# EAGLE schematic EEZ CF-DIC r3B3 (EAGLE 6.1)
Assembly variants: Farnell, TME

## Sheet 1 of 3
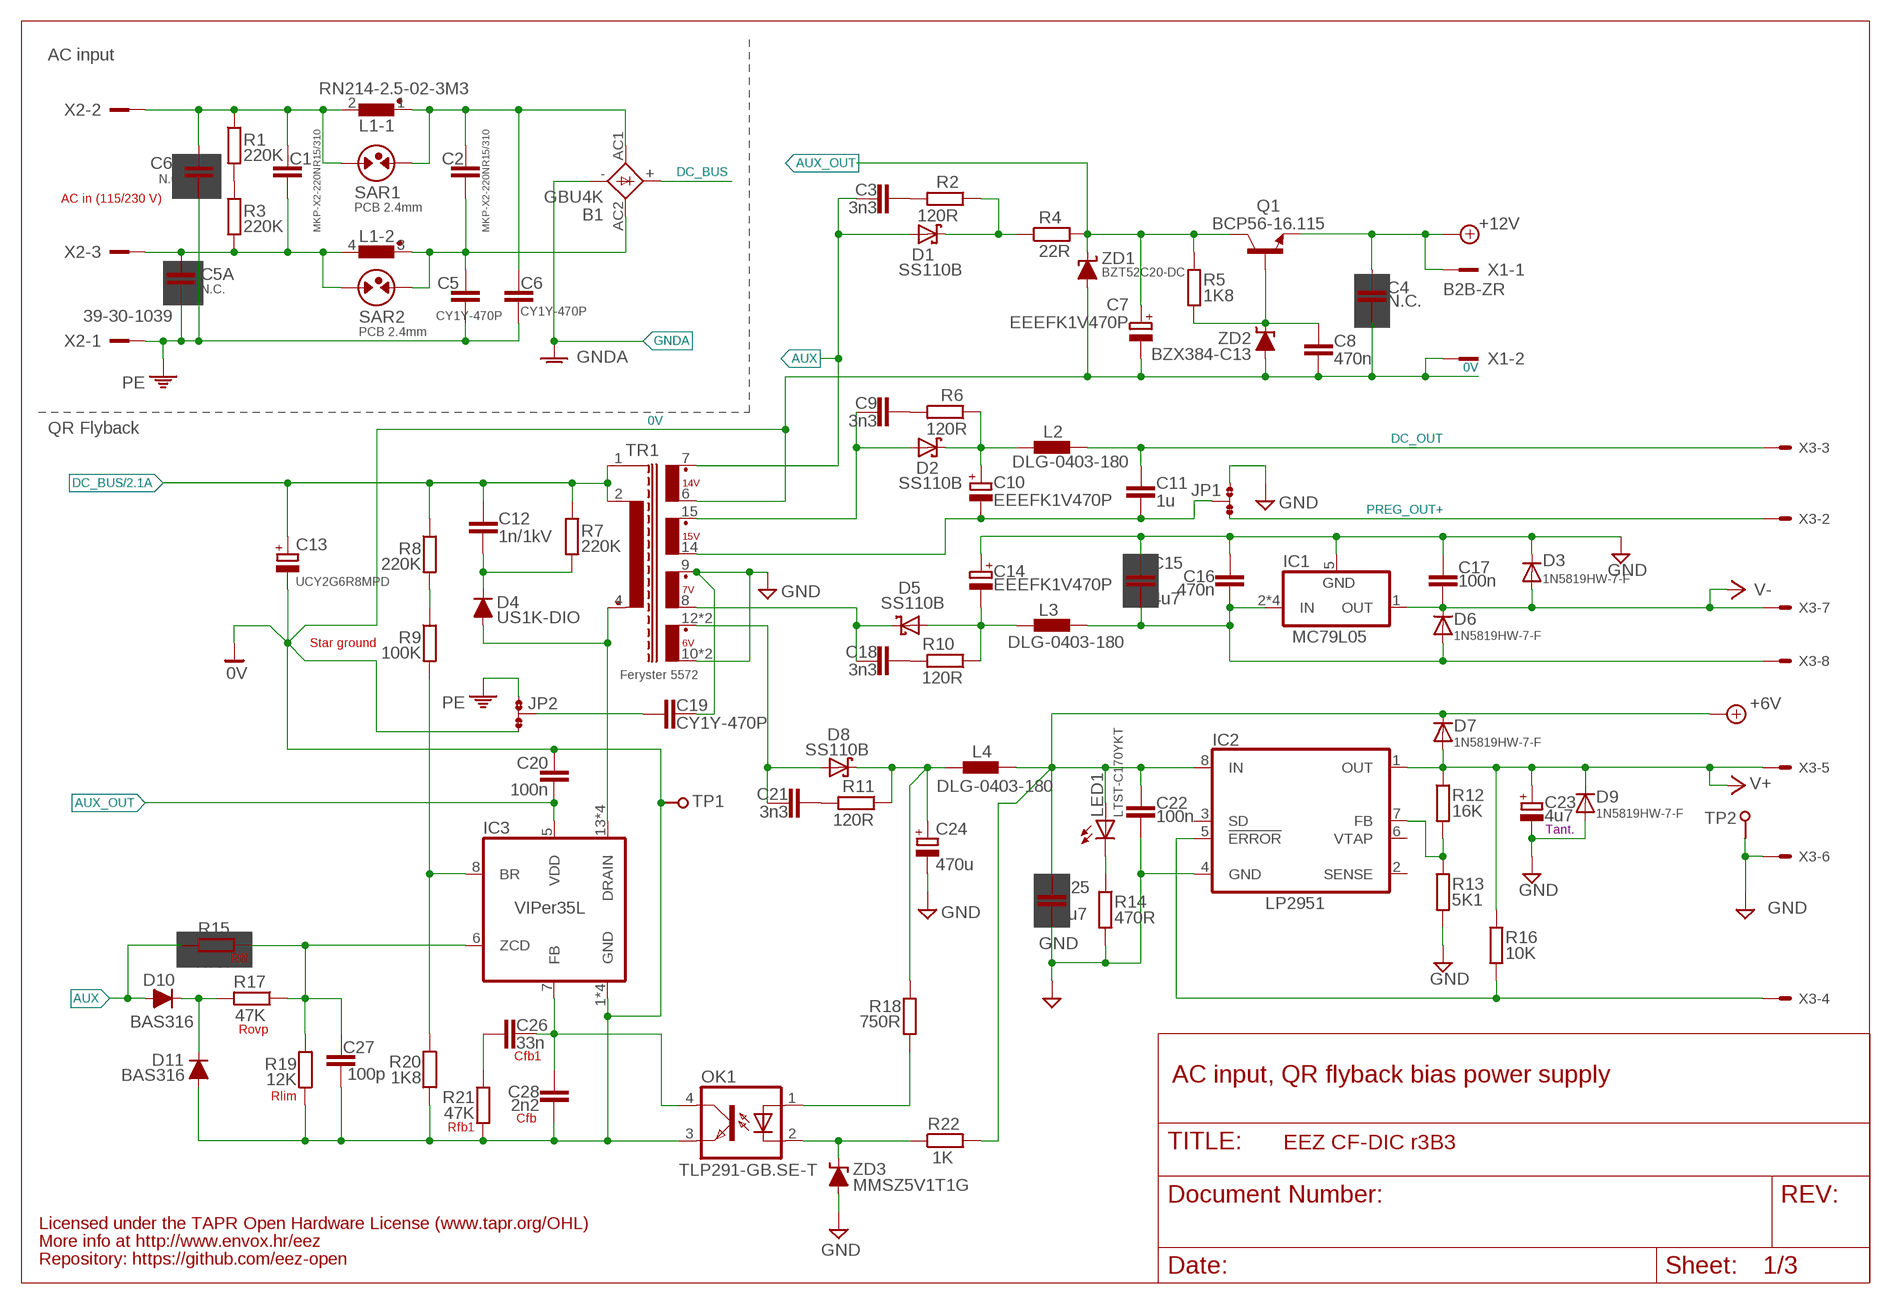
[diagram p0: schematic, sheet 1]

### Parts
B1  GBU4K  BRIDGE-CREEPAGE  [GBU4K_CRE]
C1  MKP-X2-220NR15/310  C-EU150-072X183  [C150-072X183]
C2  MKP-X2-220NR15/310  C-EU150-072X183  [C150-072X183]
C3  3n3  C-EUC0805  [C0805]
C4  N.C.  C-EUC0603  [C0603]
C5  CY1Y-470P  C-EUCY  [CY075-032X103]
C5A  N.C.  C-EUCY  [CY075-032X103]
C6  CY1Y-470P  C-EUCY  [CY075-032X103]
C6A  N.C.  C-EUCY  [CY075-032X103]
C7  EEEFK1V470P  ECAPPANASONIC_H  [CAPAE660X610N]
C8  470n  C-EUC0805  [C0805]
C9  3n3  C-EUC0805  [C0805]
C10  EEEFK1V470P  ECAPPANASONIC_H  [CAPAE660X610N]
C11  1u  C-EUC0805  [C0805]
C12  1n/1kV  C-EUC1210  [C1210]
C13  UCY2G6R8MPD  ECAP5G_10.5MM  [ECAP5/10.5]
C14  EEEFK1V470P  ECAPPANASONIC_H  [CAPAE660X610N]
C15  4u7  C-EUC1206  [C1206]
C16  470n  C-EUC0805  [C0805]
C17  100n  C-EUC0603  [C0603]
C18  3n3  C-EUC0805  [C0805]
C19  CY1Y-470P  C-EUCY  [CY075-032X103]
C20  100n  C-EUC0603  [C0603]
C21  3n3  C-EUC0805  [C0805]
C22  100n  C-EUC0603  [C0603]
C23  4u7  ECAP1206  [EC1206]
C24  470u  ECAP5G_10.5MM  [ECAP5/10.5]
C25  4u7  C-EUC1206  [C1206]
C26  33n  C-EUC0805  [C0805]
C27  100p  C-EUC0805  [C0805]
C28  2n2  C-EUC0805  [C0805]
D1  SS110B  SCHOTTKYSMB  [SMB]
D2  SS110B  SCHOTTKYSMB  [SMB]
D3  1N5819HW-7-F  DIODE-SOD323-W  [SOD323-W]
D4  US1K-DIO  DIODEDO214AA  [DO214AA]
D5  SS110B  SCHOTTKYSMB  [SMB]
D6  1N5819HW-7-F  DIODE-SOD323-W  [SOD323-W]
D7  1N5819HW-7-F  DIODE-SOD323-W  [SOD323-W]
D8  SS110B  SCHOTTKYSMB  [SMB]
D9  1N5819HW-7-F  DIODE-SOD323-W  [SOD323-W]
D10  BAS316  DIODESOD323R  [SOD323-R]
D11  BAS316  DIODESOD323R  [SOD323-R]
IC1  MC79L05  MC79LXXSOIC  [SOIC127P600X173-8N]
IC2  LP2951  LP2951SO8  [SOIC127P600X175-8N]
IC3  VIPer35L  VIPER35  [SOIC-16]
JP1  JP3-CUT  [JP3-CUT]
JP2  JP3-CUT  [JP3-CUT]
L1  RN214-2.5-02-3M3  RN214  [RN214]
L2  DLG-0403-180  DE0403  [DE0403]
L3  DLG-0403-180  DE0403  [DE0403]
L4  DLG-0403-180  DE0403  [DE0403]
LED1  LTST-C170YKT  LED0805  [LED_0805]
OK1  TLP291-GB.SE-T  TLP291  [SO4]
Q1  BCP56-16.115  BCP56  [SOT230P700X180-4N]
R1  220K  R-EU_R1206  [R1206]
R2  120R  R-EU_R0805  [R0805]
R3  220K  R-EU_R1206  [R1206]
R4  22R  R-EU_R0805  [R0805]
R5  1K8  R-EU_R0805  [R0805]
R6  120R  R-EU_R0805  [R0805]
R7  220K  R-EU_R1206  [R1206]
R8  220K  R-EU_R1206  [R1206]
R9  100K  R-EU_R0805  [R0805]
R10  120R  R-EU_R0805  [R0805]
R11  120R  R-EU_R0805  [R0805]
R12  16K  R-EU_R0805  [R0805]
R13  5K1  R-EU_R0805  [R0805]
R14  470R  R-EU_R0805  [R0805]
R15  N.C.  R-EU_R0805  [R0805]
R16  10K  R-EU_R0805  [R0805]
R17  47K  R-EU_R0805  [R0805]
R18  750R  R-EU_R0805  [R0805]
R19  12K  R-EU_R0805  [R0805]
R20  1K8  R-EU_R0805  [R0805]
R21  47K  R-EU_R0805  [R0805]
R22  1K  R-EU_R0805  [R0805]
SAR1  PCB 2.4mm  SARPCB-2.4MM  [PCB-SAR_2.4MM]
SAR2  PCB 2.4mm  SARPCB-2.4MM  [PCB-SAR_2.4MM]
TP1  PCB_TEST_TABSHIELD  [PCB_SHIELD_TAB]
TP2  PCB_TEST_TABSHIELD  [PCB_SHIELD_TAB]
TR1  Feryster 5572  FERYSTER_5572  [FERYSTER_5572]
X1  B2B-ZR  [B2B-ZR]
X2  39-30-1039  MINIFIT_39301039-CREEPAGE  [MINIFIT_39301039_CRE]
X3  90136-1208  C-GRID-08-70543  [70543-08]
ZD1  BZT52C20-DC  ZENER-DIODESOD123FL  [SOD123FL]
ZD2  BZX384-C13  ZENER-DIODESOD323  [SOD323-W]
ZD3  MMSZ5V1T1G  ZENER-DIODESOD323  [SOD323-W]

### Nets
0V: C4.2 C7.2(-) C8.2 C13.- C20.1 C27.2 C28.2 D11.A IC3.1(GND) IC3.2(GND) IC3.3(GND) IC3.4(GND) JP2.NC OK1.3(EMIT) R19.1 R20.2 R21.2 TP1.1 TR1.6(S_BIAS) X1.2 ZD1.A ZD2.A ; also sheet 2
6VAC: C21.2 D8.A TR1.12(S1_DOT) TR1.13(S1_DOT)
7VAC: C18.2 D5.C TR1.8(S2)
15VAC: C9.2 D2.A TR1.15(S3_DOT)
+6V: C22.1 C25.1 D7.C IC2.8(IN) L4.2 LED1.A R22.2 ; also sheet 3
+6V_REC: C24.+ D8.C L4.1 R11.1 R18.1
+12V: C4.1 Q1.3(E) X1.1 ; also sheet 2
+15V_REC: C10.1(+) D2.C L2.1 R6.1
-7V_REC: C14.2(-) D5.A L3.1 R10.1
-9V: C15.2 C16.2 D6.A IC1.2(IN) IC1.3(IN) IC1.6(IN) IC1.7(IN) L3.2 X3.8
-15V: C10.2(-) C11.2 JP1.COM TR1.14(S3)
AUX: C3.2 D1.A D10.A R15.2 TR1.7(S_BIAS_DOT)
AUX_OUT: C7.1(+) C20.2 IC3.5(VDD) Q1.2(C) Q1.4(C) R4.2 R5.1 ZD1.C
DC_BUS: B1.+ C12.1 C13.+ R7.1 R8.1 TR1.1(SHIELD) TR1.2(P) ; also sheet 2
DC_OUT: C11.1 L2.2 X3.3
FB2: OK1.2(C) R22.1 ZD3.C
GND: C14.1(+) C15.1 C16.1 C17.1 C19.2 C22.2 C23.- C24.- C25.2 D3.C D9.A IC1.5(GND) IC2.4(GND) JP1.NO R13.2 R14.2 TP2.1 TR1.9(S2_DOT) TR1.10(S1) TR1.11(S1) X3.6 ZD3.A ; also sheet 3
GNDA: B1.- ; also sheet 2
N$4: C19.1 JP2.COM
N$15: B1.AC1 C2.1 C6.2 L1.1 SAR1.2
N$20: IC3.8(BR) R9.2 R20.1
N$24: B1.AC2 C2.2 C5.2 L1.3 SAR2.2
N$27: D1.C R2.1 R4.1
N$28: C1.1 C6A.2 L1.2 R1.1 SAR1.1 X2.2
N$30: C1.2 C5A.2 L1.4 R3.2 SAR2.1 X2.3
N$33: R1.2 R3.1
N$49: R8.2 R9.1
N$101: IC2.7(FB) R12.2 R13.1
N$133: C8.1 Q1.1(B) R5.2 ZD2.C
N$135: OK1.1(A) R18.2
N$136: LED1.C R14.1
N$137: C12.2 D4.C R7.2
N$138: C26.2 C28.1 IC3.7(FB) OK1.4(COL)
N$139: C9.1 R6.2
N$140: C3.1 R2.2
N$141: C27.1 IC3.6(ZCD) R15.1 R17.1 R19.2
N$144: C18.1 R10.2
N$146: C21.1 R11.2
N$152: C26.1 R21.1
N$155: D10.C D11.C R17.2
PE: C5.1 C5A.1 C6.1 C6A.1 JP2.NO X2.1
PREG_OUT+: JP1.NC X3.2 ; also sheet 3
PWRGOOD: IC2.5(!ERROR) R16.2 X3.4
V+: C23.+ D7.A D9.C IC2.1(OUT) R12.1 R16.1 X3.5 ; also sheet 3
V-: C17.2 D3.A D6.C IC1.1(OUT) X3.7 ; also sheet 3
VIPER_D: D4.A IC3.13(DRAIN) IC3.14(DRAIN) IC3.15(DRAIN) IC3.16(DRAIN) TR1.4(P2_DOT)
Unconnected: IC2.2(SENSE) IC2.3(SD) IC2.6(VTAP)

### Notes on the sheet
- AC input
- AC in (115/230 V)
- QR Flyback
- Star ground
- Tant.
- Rff
- Rovp
- Cfb1
- AC input, QR flyback bias power supply
- Rlim
- Cfb
- Rfb1
- Licensed under the TAPR Open Hardware License (www.tapr.org/OHL)
- More info at http://www.envox.hr/eez
- Repository: https://github.com/eez-open

## Sheet 2 of 3
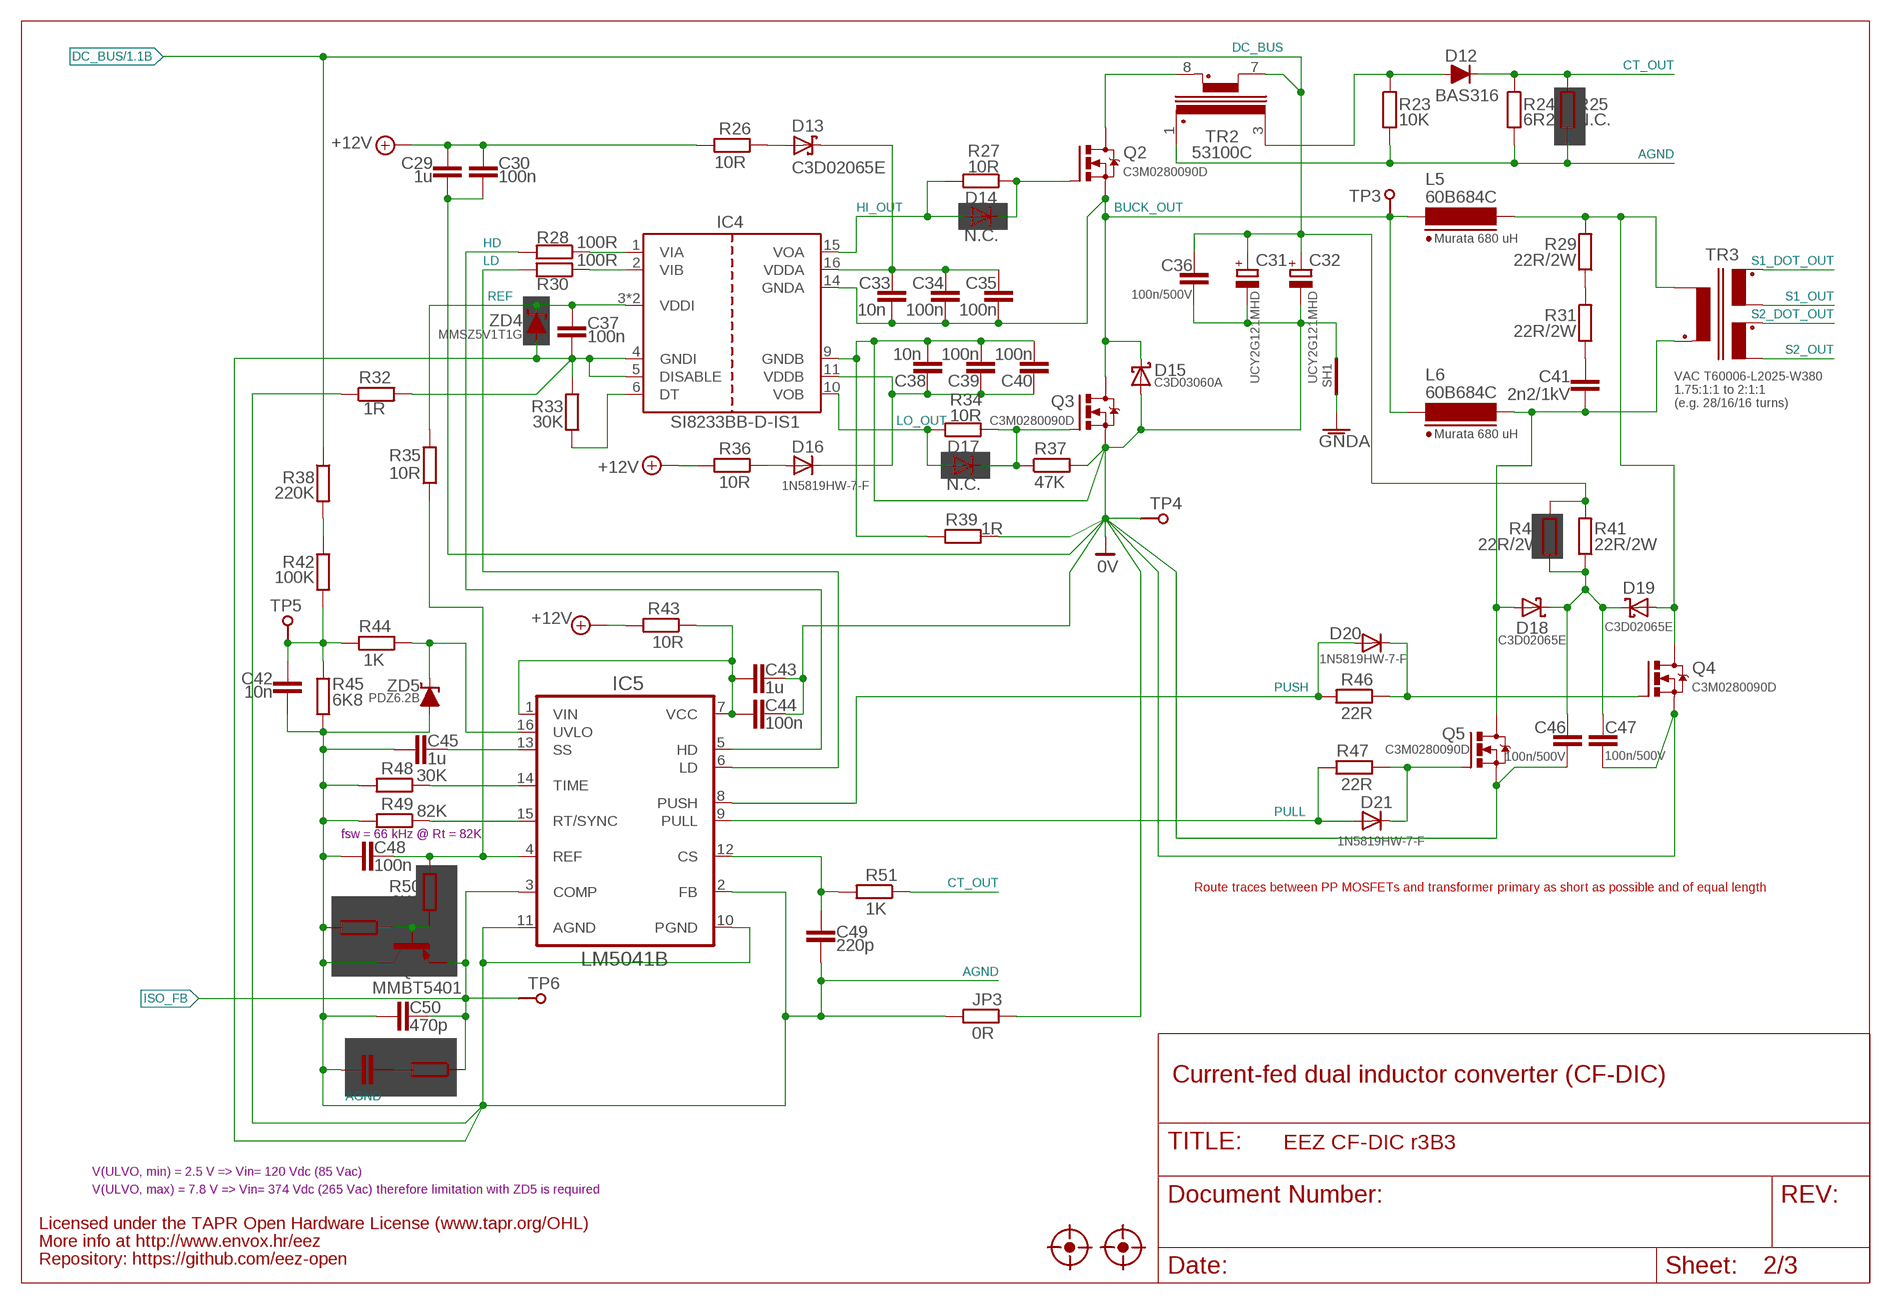
[diagram p1: schematic, sheet 2]

### Parts
C29  1u  C-EUC0805  [C0805]
C30  100n  C-EUC0603  [C0603]
C31  UCY2G121MHD  ECAP7.5G_18MM  [ECAP7.5/18]
C32  UCY2G121MHD  ECAP7.5G_18MM  [ECAP7.5/18]
C33  10n  C-EUC0603  [C0603]
C34  100n  C-EUC0603  [C0603]
C35  100n  C-EUC0603  [C0603]
C36  100n/500V  C-EUC1812  [C1812]
C37  100n  C-EUC0603  [C0603]
C38  10n  C-EUC0603  [C0603]
C39  100n  C-EUC0603  [C0603]
C40  100n  C-EUC0603  [C0603]
C41  2n2/1kV  C-EUC1210  [C1210]
C42  10n  C-EUC0603  [C0603]
C43  1u  C-EUC0805  [C0805]
C44  100n  C-EUC0603  [C0603]
C45  1u  C-EUC0805  [C0805]
C46  100n/500V  C-EUC1812  [C1812]
C47  100n/500V  C-EUC1812  [C1812]
C48  100n  C-EUC0603  [C0603]
C49  220p  C-EUC0805  [C0805]
C50  470p  C-EUC0805  [C0805]
C51  N.C.  C-EUC0805  [C0805]
D12  BAS316  DIODESOD323R  [SOD323-R]
D13  C3D02065E  SCHOTTKY-2  [TO252]
D14  N.C.  DIODE-SOD323-W  [SOD323-W]
D15  C3D03060A  SCHOTTKY-TO220  [TO220-2]
D16  1N5819HW-7-F  DIODE-SOD323-W  [SOD323-W]
D17  N.C.  DIODE-SOD323-W  [SOD323-W]
D18  C3D02065E  SCHOTTKY-2  [TO252]
D19  C3D02065E  SCHOTTKY-2  [TO252]
D20  1N5819HW-7-F  DIODE-SOD323-W  [SOD323-W]
D21  1N5819HW-7-F  DIODE-SOD323-W  [SOD323-W]
FM1  FIDUCIAL_2  [FIDUCIAL_DUAL]
FM2  FIDUCIAL_2  [FIDUCIAL_DUAL]
IC4  SI8233BB-D-IS1  SI8233  [SOIC-16]
IC5  LM5041B  LM5041  [MTC16]
JP3  0R  R-EU_R0805  [R0805]
L5  60B684C  MURATA_6000B  [MURATA_6000B]
L6  60B684C  MURATA_6000B  [MURATA_6000B]
Q2  C3M0280090D  IRFP240  [TO247BV]
Q3  C3M0280090D  IRFP240  [TO247BV]
Q4  C3M0280090D  IRFP240  [TO247BV]
Q5  C3M0280090D  IRFP240  [TO247BV]
Q6  MMBT5401  BC857B-PNP-SOT23-BEC  [SOT23-BEC]
R23  10K  R-EU_R0805  [R0805]
R24  6R2  R-EU_R0805  [R0805]
R25  N.C.  R-EU_R0805  [R0805]
R26  10R  R-EU_R0805  [R0805]
R27  10R  R-EU_R0805  [R0805]
R28  100R  R-EU_R0805  [R0805]
R29  22R/2W  R-EU_R2512  [R2512]
R30  100R  R-EU_R0805  [R0805]
R31  22R/2W  R-EU_R2512  [R2512]
R32  1R  R-EU_R0805  [R0805]
R33  30K  R-EU_R0805  [R0805]
R34  10R  R-EU_R0805  [R0805]
R35  10R  R-EU_R0805  [R0805]
R36  10R  R-EU_R0805  [R0805]
R37  47K  R-EU_R0805  [R0805]
R38  220K  R-EU_R1206  [R1206]
R39  1R  R-EU_R0805  [R0805]
R40  22R/2W  R-EU_R2512  [R2512]
R41  22R/2W  R-EU_R2512  [R2512]
R42  100K  R-EU_R0805  [R0805]
R43  10R  R-EU_R0805  [R0805]
R44  1K  R-EU_R0805  [R0805]
R45  6K8  R-EU_R0805  [R0805]
R46  22R  R-EU_R0805  [R0805]
R47  22R  R-EU_R0805  [R0805]
R48  30K  R-EU_R0805  [R0805]
R49  82K  R-EU_R0805  [R0805]
R50  6K8  R-EU_R0805  [R0805]
R51  1K  R-EU_R0805  [R0805]
R52  6K8  R-EU_R0805  [R0805]
R53  N.C.  R-EU_R0805  [R0805]
SH1  SHORTNOHOLE  [SHORT_NOHOLE]
TP3  PCB_TEST_TABSHIELD  [PCB_SHIELD_TAB]
TP4  PCB_TEST_TABSHIELD  [PCB_SHIELD_TAB]
TP5  PCB_TEST_TABSHIELD  [PCB_SHIELD_TAB]
TP6  PCB_TEST_TABSHIELD  [PCB_SHIELD_TAB]
TR2  53100C  MURATA_5300  [MURATA_5300]
TR3  VAC T60006-L2025-W380  PCB_TRAFO_FLYBACK2-VAC  [VAC_DUAL_SEC]
ZD4  MMSZ5V1T1G  ZENER-DIODESOD323  [SOD323-W]
ZD5  PDZ6.2B  ZENER-DIODESOD323  [SOD323-W]

### Nets
0V: C29.1 C30.1 C31.- C32.- C36.1 C38.2 C39.2 C40.2 C43.2 C44.2 C46.1 C47.1 D15.2(A) IC4.9(GNDB) JP3.1 Q3.S Q4.S Q5.S R37.2 R39.1 R39.2 SH1.P$2(GND_B) TP4.1 ; also sheet 1
+12V: C29.2 C30.2 R26.2 R36.2 R43.2 ; also sheet 1
AGND: C37.1 C42.2 C45.1 C48.1 C49.1 C50.1 C51.1 IC4.4(GNDI) IC4.5(DISABLE) IC5.2(FB) IC5.10(PGND) IC5.11(AGND) JP3.2 Q6.C R23.2 R24.2 R25.2 R32.1 R32.2 R33.1 R45.2 R48.2 R49.2 R52.2 TR2.1(S_DOT) ZD4.A ZD5.A ; also sheet 3
BUCK_OUT: C33.2 C34.2 C35.2 D15.1(C) IC4.14(GNDA) L5.2 L6.2 Q2.S Q3.D TP3.1
CLAMP_C: C46.2 C47.2 D18.1(C) D18.3(C) D19.1(C) D19.3(C) R40.1 R41.1
CT_OUT: D12.C R24.1 R25.1 R51.1
DC_BUS: C31.+ C32.+ C36.2 R38.1 R40.2 R41.2 TR2.7(P) ; also sheet 1
GNDA: SH1.P$1(GND_A) ; also sheet 1
HD: IC5.5(HD) R28.2
HI_OUT: D14.A IC4.15(VOA) R27.2
ISO_FB: C50.2 IC5.3(COMP) Q6.E R53.1 TP6.1 ; also sheet 3
L_PULL: C41.2 D18.2(A) L6.1 Q5.D TR3.P1_DOT(P_DOT)
L_PUSH: D19.2(A) L5.1 Q4.D R29.2 TR3.P1(P)
LD: IC5.6(LD) R30.2
LO_OUT: D17.A IC4.10(VOB) R34.1
N$2: R38.2 R42.1
N$3: C33.1 C34.1 C35.1 D13.1(C) D13.3(C) IC4.16(VDDA)
N$5: C41.1 R31.1
N$13: D20.C Q4.G R46.1
N$14: D21.C Q5.G R47.1
N$19: IC5.15(RT/SYNC) R49.1
N$21: D14.C Q2.G R27.1
N$22: IC5.14(TIME) R48.1
N$23: C45.2 IC5.13(SS)
N$25: IC5.16(UVLO) R44.1 ZD5.C
N$29: D17.C Q3.G R34.2 R37.1
N$31: D13.2(A) R26.1
N$35: C51.2 R53.2
N$36: IC4.1(VIA) R28.1
N$37: C49.2 IC5.12(CS) R51.2
N$40: IC4.2(VIB) R30.1
N$41: R29.1 R31.2
N$47: Q6.B R50.2 R52.1
N$48: IC4.6(DT) R33.2
N$50: D12.A R23.1 TR2.3(S)
N$54: C43.1 C44.1 IC5.1(VIN) IC5.7(VCC) R43.1
N$55: C38.1 C39.1 C40.1 D16.C IC4.11(VDDB)
N$56: Q2.D TR2.8(P_DOT)
N$63: D16.A R36.1
N$65: C48.2 IC5.4(REF) R35.1 R50.1
PULL: D21.A IC5.9(PULL) R47.2
PUSH: D20.A IC5.8(PUSH) R46.2
REF: C37.2 IC4.3(VDDI) IC4.8(VDDI) R35.2 ZD4.C
S1_DOT_OUT: TR3.S1_DOT ; also sheet 3
S1_OUT: TR3.S1 ; also sheet 3
S2_DOT_OUT: TR3.S2_DOT ; also sheet 3
S2_OUT: TR3.S2 ; also sheet 3
ULVO: C42.1 R42.2 R44.2 R45.1 TP5.1

### Notes on the sheet
- Murata 680 uH
- 1.75:1:1 to 2:1:1
- (e.g. 28/16/16 turns)
- Murata 680 uH
- fsw = 66 kHz @ Rt = 82K
- Route traces between PP MOSFETs and transformer primary as short as possible and of equal length
- Current-fed dual inductor converter (CF-DIC)
- V(ULVO, min) = 2.5 V => Vin= 120 Vdc (85 Vac)
- V(ULVO, max) = 7.8 V => Vin= 374 Vdc (265 Vac) therefore limitation with ZD5 is required
- Licensed under the TAPR Open Hardware License (www.tapr.org/OHL)
- More info at http://www.envox.hr/eez
- Repository: https://github.com/eez-open

## Sheet 3 of 3
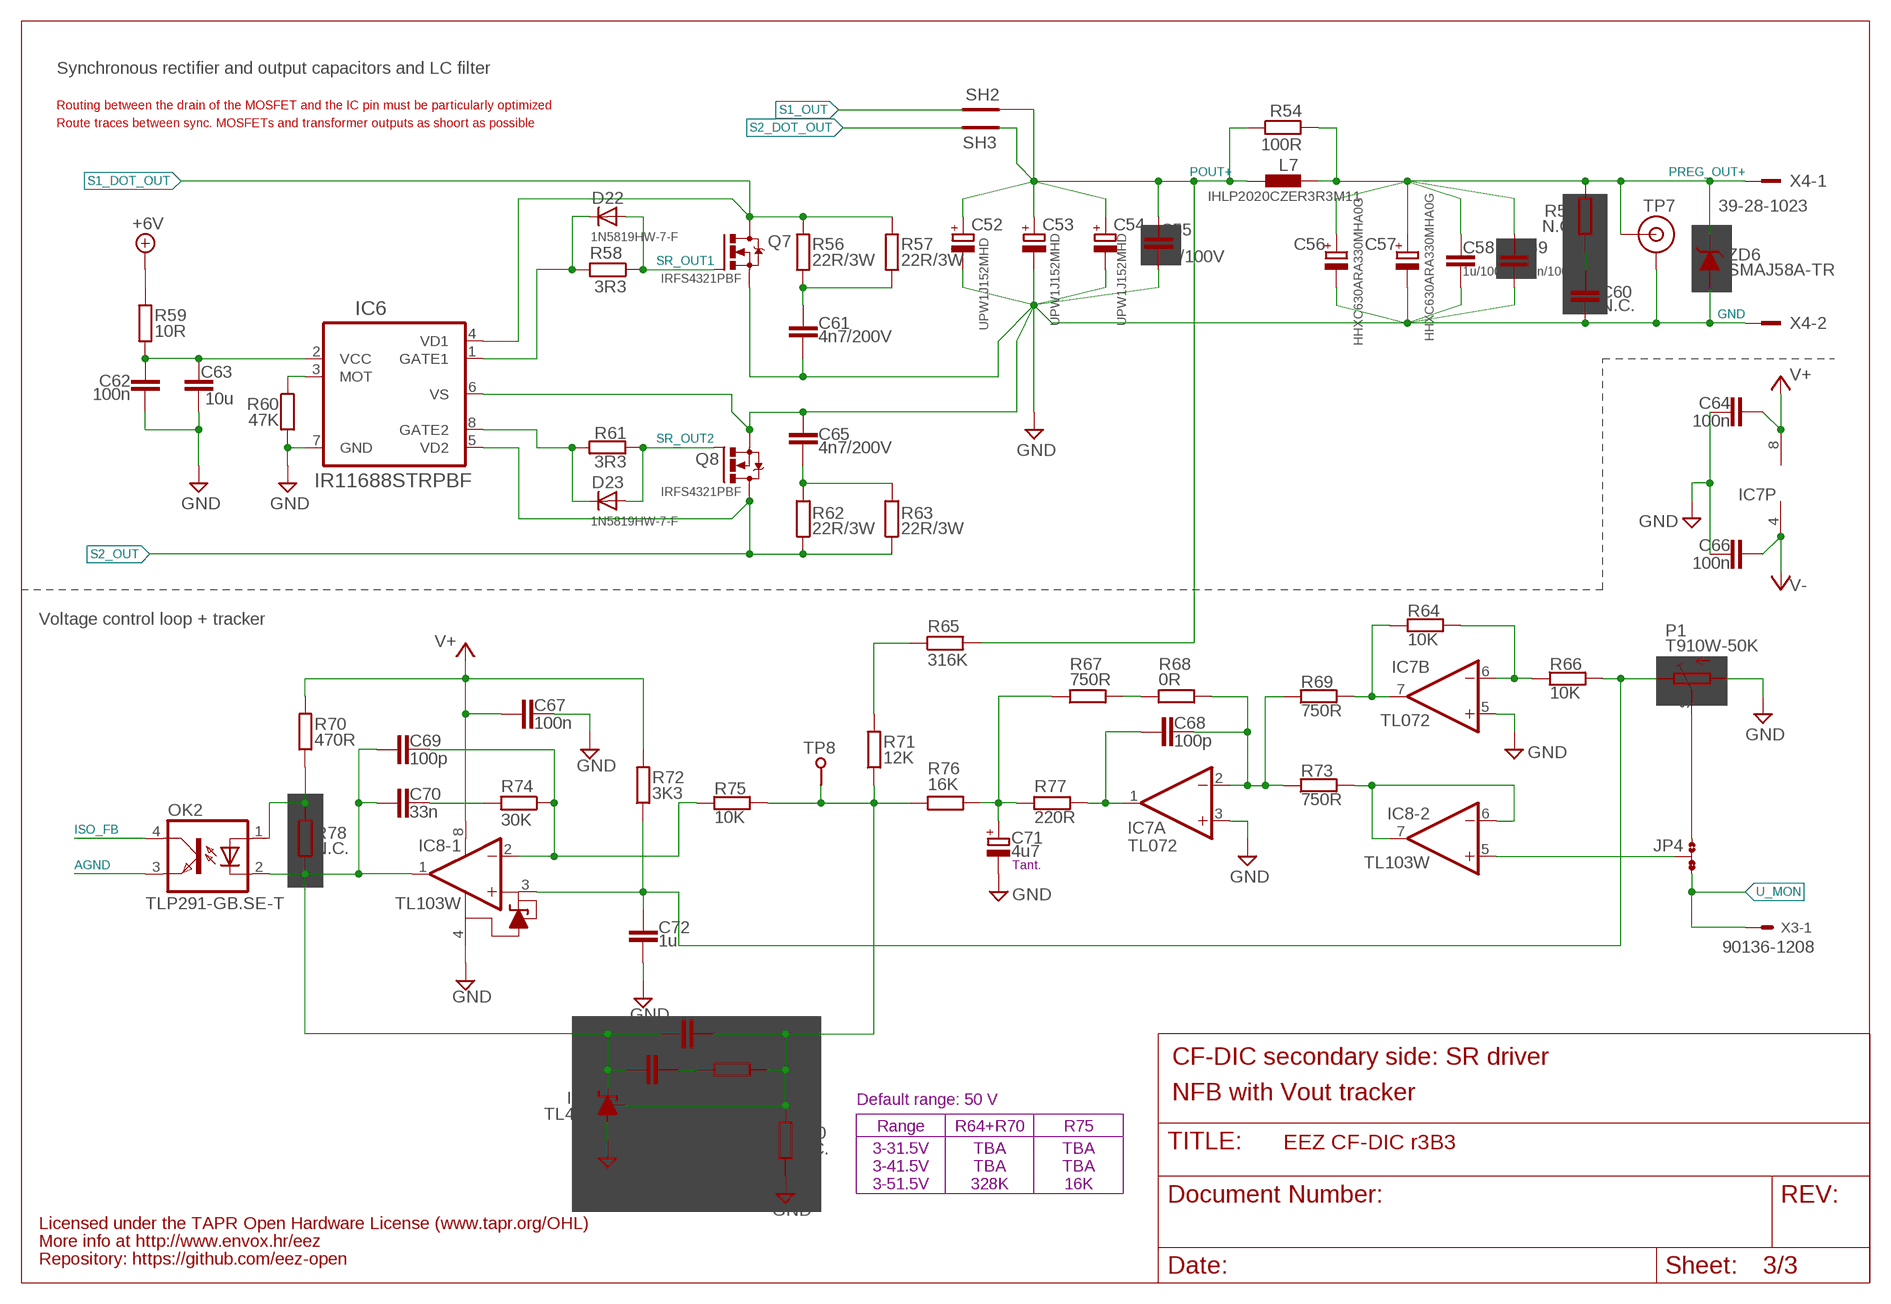
[diagram p2: schematic, sheet 3]

### Parts
C52  UPW1J152MHD  ECAP7.5G_18MM  [ECAP7.5/18]
C53  UPW1J152MHD  ECAP7.5G_18MM  [ECAP7.5/18]
C54  UPW1J152MHD  ECAP7.5G_18MM  [ECAP7.5/18]
C55  1u/100V  C-EUC1206  [C1206]
C56  HHXC630ARA330MHA0G  EEE-FK1J470P-CASE-F  [CAPAE830X1050N]
C57  HHXC630ARA330MHA0G  EEE-FK1J470P-CASE-F  [CAPAE830X1050N]
C58  1u/100V  C-EUC1206  [C1206]
C59  100n/100V  C-EUC0805  [C0805]
C60  N.C.  C-EUC1206  [C1206]
C61  4n7/200V  C-EUC1206  [C1206]
C62  100n  C-EUC0603  [C0603]
C63  10u  C-EUC1210  [C1210]
C64  100n  C-EUC0603  [C0603]
C65  4n7/200V  C-EUC1206  [C1206]
C66  100n  C-EUC0603  [C0603]
C67  100n  C-EUC0603  [C0603]
C68  100p  C-EUC0805  [C0805]
C69  100p  C-EUC0805  [C0805]
C70  33n  C-EUC0805  [C0805]
C71  4u7  ECAP1206  [EC1206]
C72  1u  C-EUC0805  [C0805]
C73  N.C.  C-EUC0805  [C0805]
C74  N.C.  C-EUC0805  [C0805]
D22  1N5819HW-7-F  DIODE-SOD323-W  [SOD323-W]
D23  1N5819HW-7-F  DIODE-SOD323-W  [SOD323-W]
IC6  IR11688STRPBF  IR11688  [SO8]
IC7  TL072  TL072SOIC8  [SOIC127P600X173-8N]
IC8  TL103W  [SOIC127P600X173-8N]
IC9  TL431  [SOT103P240X110-3N]
JP4  JP3-CUT  [JP3-CUT]
L7  IHLP2020CZER3R3M11  IHLP-2020BZ-11  [IHLP-2020BZ-11]
OK2  TLP291-GB.SE-T  TLP291  [SO4]
P1  T910W-50K  TRIM_EU-S64W  [S64W]
Q7  IRFS4321PBF  N-MOSFETTO263  [TO263]
Q8  IRFS4321PBF  N-MOSFETTO263  [TO263]
R54  100R  R-EU_R0805  [R0805]
R55  N.C.  R-EU_R1210  [R1210]
R56  22R/3W  R-EU_R2512  [R2512]
R57  22R/3W  R-EU_R2512  [R2512]
R58  3R3  R-EU_R0805  [R0805]
R59  10R  R-EU_R0805  [R0805]
R60  47K  R-EU_R0805  [R0805]
R61  3R3  R-EU_R0805  [R0805]
R62  22R/3W  R-EU_R2512  [R2512]
R63  22R/3W  R-EU_R2512  [R2512]
R64  10K  R-EU_R0805  [R0805]
R65  316K  R-EU_R0805  [R0805]
R66  10K  R-EU_R0805  [R0805]
R67  750R  R-EU_R0805  [R0805]
R68  0R  R-EU_R0805  [R0805]
R69  750R  R-EU_R0805  [R0805]
R70  470R  R-EU_R0805  [R0805]
R71  12K  R-EU_R0805  [R0805]
R72  3K3  R-EU_R0805  [R0805]
R73  750R  R-EU_R0805  [R0805]
R74  30K  R-EU_R0805  [R0805]
R75  10K  R-EU_R0805  [R0805]
R76  16K  R-EU_R0805  [R0805]
R77  220R  R-EU_R0805  [R0805]
R78  N.C.  R-EU_R0805  [R0805]
R79  N.C.  R-EU_R0805  [R0805]
R80  N.C.  R-EU_R0805  [R0805]
SH2  SHORTNOHOLE  [SHORT_NOHOLE]
SH3  SHORTNOHOLE  [SHORT_NOHOLE]
TP7  TEST_POINT-2  [TP_1.1MM_2]
TP8  PCB_TEST_TABSHIELD  [PCB_SHIELD_TAB]
X4  39-28-1023  MINIFIT_5566-02A  [MINIFIT_5566-02A]
ZD6  SMAJ58A-TR  PSMAXX  [DO214AC]

### Nets
+6V: R59.1 ; also sheet 1
AGND: OK2.3(EMIT) ; also sheet 2
FB: C73.2 IC9.2(REF) R71.1 R75.2 R76.2 R79.2 R80.2 TP8.1
GND: C52.- C53.- C54.- C55.2 C56.2 C57.2 C58.2 C59.2 C60.1 C61.2 C62.2 C63.2 C64.2 C65.2 C66.2 C67.2 C71.- C72.2 IC6.6(VS) IC6.7(GND) IC7.3(A:+IN) IC7.5(B:+IN) IC8.4(-1:VCC-) IC9.3(A) P1.A Q7.2(S) Q8.2(S) R60.2 R80.1 TP7.GND X4.2 ZD6.A ; also sheet 1
ISO_FB: OK2.4(COL) ; also sheet 2
N$1: C68.2 IC7.2(A:-IN) R68.2 R69.1 R73.1
N$6: C62.1 C63.1 IC6.2(VCC) R59.2
N$7: C72.1 IC8.3(-1:+IN1) P1.E R66.2 R72.1
N$8: C60.2 R55.1
N$9: C70.2 R74.2
N$10: C69.2 IC8.2(-1:-IN1) R74.1 R75.1
N$12: R65.1 R71.2
N$17: C74.2 R79.1
N$18: IC6.3(MOT) R60.1
N$53: IC7.7(B:OUT) R64.1 R69.2
N$57: IC8.5(-2:+IN) JP4.COM
N$58: JP4.NO P1.S
N$64: R67.2 R68.1
N$66: C61.1 R56.2 R57.2
N$67: C65.1 R62.2 R63.2
N$74: D22.C IC6.1(GATE1) R58.2
N$75: D23.C IC6.8(GATE2) R61.2
N$76: C69.1 C70.1 C73.1 C74.1 IC8.1(-1:OUT1) IC9.1(C) OK2.2(C) R78.2
N$132: IC7.6(B:-IN) R64.2 R66.1
N$134: C68.1 IC7.1(A:OUT) R77.2
NFB_OFFSET: C71.+ R67.1 R76.1 R77.1
OK_A: OK2.1(A) R70.1 R78.1
POUT+: C52.+ C53.+ C54.+ C55.1 L7.1 R54.1 R65.2 SH2.P$2(GND_B) SH3.P$1(GND_A)
PREG_OUT+: C56.1 C57.1 C58.1 C59.1 L7.2 R54.2 R55.2 TP7.TIP X4.1 ZD6.C ; also sheet 1
S1_DOT_OUT: IC6.4(VD1) Q7.3(D) R56.1 R57.1 ; also sheet 2
S1_OUT: SH2.P$1(GND_A) ; also sheet 2
S2_DOT_OUT: SH3.P$2(GND_B) ; also sheet 2
S2_OUT: IC6.5(VD2) Q8.3(D) R62.1 R63.1 ; also sheet 2
SR_OUT1: D22.A Q7.1(G) R58.1
SR_OUT2: D23.A Q8.1(G) R61.1
U_MON: JP4.NC X3.1
U_MON1: IC8.6(-2:-IN) IC8.7(-2:OUT) R73.2
V+: C64.1 C67.1 IC7.8(P:V+) IC8.8(-1:VCC+) R70.2 R72.2 ; also sheet 1
V-: C66.1 IC7.4(P:V-) ; also sheet 1

### Notes on the sheet
- Synchronous rectifier and output capacitors and LC filter
- Routing between the drain of the MOSFET and the IC pin must be particularly optimized
- Route traces between sync. MOSFETs and transformer outputs as shoort as possible
- Voltage control loop + tracker
- Tant.
- CF-DIC secondary side: SR driver
- Default range: 50 V | NFB with Vout tracker
- Range | R64+R70 | R75
- 3-31.5V | TBA | TBA
- 3-41.5V | TBA | TBA
- 3-51.5V | 328K | 16K
- Licensed under the TAPR Open Hardware License (www.tapr.org/OHL)
- More info at http://www.envox.hr/eez
- Repository: https://github.com/eez-open

## Library data of the parts
B1 = EEZ_Lib1:BRIDGE
C1-C4 C8 C9 C11 C12 C15-C18 C20-C22 C25-C30 C33-C51 C55 C58-C70 C72-C74 = rcl:C-EU: CAPACITOR, European symbol
C5 C5A C6 C6A C19 = EEZ_Lib1:C-EU
C7 C10 C13 C14 C23 C24 C31 C32 C52-C54 C71 = EEZ_Lib1:ECAP
C56 C57 = Panasonic-EEEFK_EEEFP:EEE-: Aluminum Electrolytic Capacitors,Surface Mount Type; MPN: EEE-FK1J470P; OC_FARNELL: 9696032; OC_NEWARK: 96K9403; PACKAGE: CASE-F; SUPPLIER: PANASONIC; TOLERANCE: ±20 %; VALUE: 47UF; VOLTAGERATING: 63 V
D1 D2 D5 D8 D13 D15 D18 D19 = EEZ_Lib1:SCHOTTKY
D3 D6 D7 D9 D14 D16 D17 D20-D23 = diode:DIODE-: DIODE
D4 D10-D12 = EEZ_Lib1:DIODE
FM1 FM2 = EEZ_Lib1:FIDUCIAL: Fiducial mark for pick and place automation
IC1 = EEZ_Lib1:MC79LXX: 3-terminal negative voltage regulator, up to 100mA
IC2 = EEZ_Lib1:LP2951: LP2950-N/LP2951-N Series of Adjustable Micropower Voltage Regulators
IC3 = EEZ_Lib1:VIPER35: Quasi-resonant high performance off line high voltage converter, 800 V
IC4 = EEZ_Lib1:SI8233: Dual 4.0 Amp ISOdrivers with deadtime control and overlap protection
IC5 = EEZ_Lib1:LM5041: Cascaded PWM Controller; MANUFACTURER_PART_NUMBER: lm5041mtcnopb; VENDOR: TI
IC6 = EEZ_Lib1:IR11688: Dual smart rectifier driver IC with programmable MOT
IC7 = EEZ_Lib1:TL072
IC8 = EEZ_Lib1:TL103W: Dual Operational Amplifiers With Internal Reference
IC9 = EEZ_Lib1:TL431: Precision programmable reference
JP1 JP2 JP4 = EEZ_Lib1:JP3-CUT: 2-way SMT jumper with one position connected
JP3 R1-R80 = rcl:R-EU_: RESISTOR, European symbol
L1 = EEZ_inductors_and_transformers:RN214: Schaffner EMC/EMI current-compensated chokes, vertical case; FARNELL: 1191518
L2-L4 = EEZ_inductors_and_transformers:DE0403: Ferrocore SMD power coil 4.0 x 4.5 mm
L5 L6 = EEZ_inductors_and_transformers:MURATA_6000B: Surface Mount Power Inductors (47μH to 680μH)
L7 = EEZ_inductors_and_transformers:IHLP-2020BZ-11: Low Profile, High Current IHLP® Inductors
LED1 = EEZ_Lib1:LED
OK1 OK2 = EEZ_Lib1:TLP291: Toshiba Photocopler GaAs IRED & Photo-transistor
P1 = pot:TRIM_EU-: POTENTIOMETER
Q1 = EEZ_Lib1:BCP56: Low power NPN Transistor, Vceo=80V, Ic=1A, SOT-223
Q2-Q5 = EEZ_Lib1:IRFP240: N-channel MOSFET (TO-247)
Q6 = transistor:*-PNP-: PNP Transistror
Q7 Q8 = EEZ_Lib1:N-MOSFET
SAR1 SAR2 = EEZ_Lib1:SAR: EPCOS surge arrester EF470X Farnell: 1886596
SH1-SH3 = EEZ_Lib1:SHORT
TP1-TP6 TP8 = EEZ_Lib1:PCB_TEST_TAB
TP7 = EEZ_Lib1:TEST_POINT: Test point for oscilloscope probe
TR1 = EEZ_inductors_and_transformers:FERYSTER_5572
TR2 = EEZ_inductors_and_transformers:MURATA_5300: 10A Current sensing transformers
TR3 = EEZ_inductors_and_transformers:PCB_TRAFO_FLYBACK2: PCB flyback transformer, dual secondary, no AUX
X1 = EEZ_Lib1:B2B-ZR: JST Socket; wire-board; male; ZH; 1.5mm; PIN:2; THT; 50V; 1A
X2 = EEZ_Lib1:MINIFIT_39301039: MOLEX socket; wire-board; male; Mini-Fit Jr; 4.2mm; PIN:3; THT; PCB snap
X3 = con-molex:C-GRID-08: CONNECTOR wire to board 2.54 mm (0.100") pitch header; OC_FARNELL: unknown; OC_NEWARK: unknown
X4 = EEZ_Lib1:MINIFIT_5566-02A: Molex Socket; wire-board; male; Mini-Fit Jr; 4.2mm; PIN:2; THT; 9A; tinned
ZD1-ZD5 = EEZ_Lib1:ZENER-DIODE
ZD6 = EEZ_Lib1:PSMAXX: Transient Voltage Suppressor, TVS, P4SMA Series, Unidirectional

## Net classes
0 default: width 0.203 mm, drill 0.3 mm, clearance 0.203 mm
1 lvds: width 0.152 mm, drill 0.3 mm, clearance 0.152 mm to class 0, clearance 0.152 mm
2 gnd: width 0.254 mm, drill 0.584 mm, clearance 0.254 mm